# EAGLE design ABMS - VFG - TTL (EAGLE 5.10)
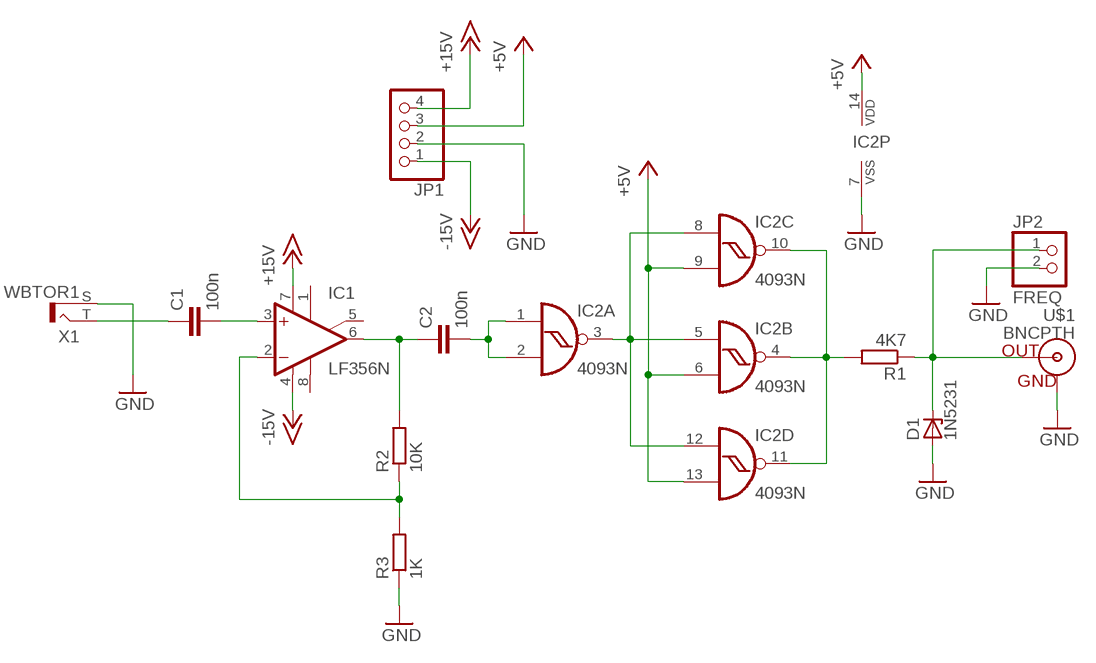
[diagram p0: schematic, sheet 1]

## Parts
C1  100n  C-EU075-032X103  [C075-032X103]
C2  100n  C-EU075-032X103  [C075-032X103]
D1  1N5231  ZENER-DIODEDO41Z10  [DO41Z10]
IC1  LF356N  [DIL08]
IC2  4093N  [DIL14]
JP1  PINHD-1X4  [1X04]
JP2  FREQ  PINHD-1X2  [1X02]
R1  4K7  R-EU_0207/10  [0207/10]
R2  10K  R-EU_0207/10  [0207/10]
R3  1K  R-EU_0207/10  [0207/10]
U$1  BNCPTH  [BNC]
X1  WBTOR1  [WBTOR1]

## Nets
+5V: IC2.6(B:I1) IC2.9(C:I1) IC2.13(D:I1) IC2.14(P:VDD) JP1.3
+15V: IC1.7(V+) JP1.4
-15V: IC1.4(V-) JP1.1
GND: D1.A IC2.7(P:VSS) JP1.2 JP2.2 R3.1 U$1.GND X1.S
N$1: IC2.3(A:O) IC2.5(B:I0) IC2.8(C:I0) IC2.12(D:I0)
N$3: C2.1 IC1.6(OUT) R2.2
N$4: IC2.4(B:O) IC2.10(C:O) IC2.11(D:O) R1.2
N$5: C2.2 IC2.1(A:I0) IC2.2(A:I1)
N$6: IC1.2(-IN) R2.1 R3.2
N$7: C1.2 IC1.3(+IN)
N$8: D1.C JP2.1 R1.1 U$1.S(OUT)
N$9: C1.1 X1.T
Unconnected: IC1.1(ON1) IC1.5(ON2) IC1.8(OPT)

## Library data of the parts
C1 C2 = resistor:C-EU: CAPACITOR, European symbol
D1 = diode:ZENER-DIODE: Z-Diode
IC1 = linear:LF356: OP AMP
IC2 = 40xx:4093: Quad 2-input NAND schmitt trigger
JP1 = pinhead:PINHD-1X4: PIN HEADER
JP2 = pinhead:PINHD-1X2: PIN HEADER
R1-R3 = resistor:R-EU_: RESISTOR, European symbol
U$1 = SparkFun:BNC: BNC Connector, Mouser Part# 5227161
X1 = con-lumberg:WBTOR1: RCA connectors according to JEITA RC-5231 Cinch RCA-Einbaukupplung nach JEITA RC-5231, abgewinkelte Ausführung Source: http://www.lumberg.de/Produkte/PDFs/WBTOR1.pdf

## Net classes
0 default: width 0.508 mm, drill 0.762 mm, clearance 0.508 mm

## Board
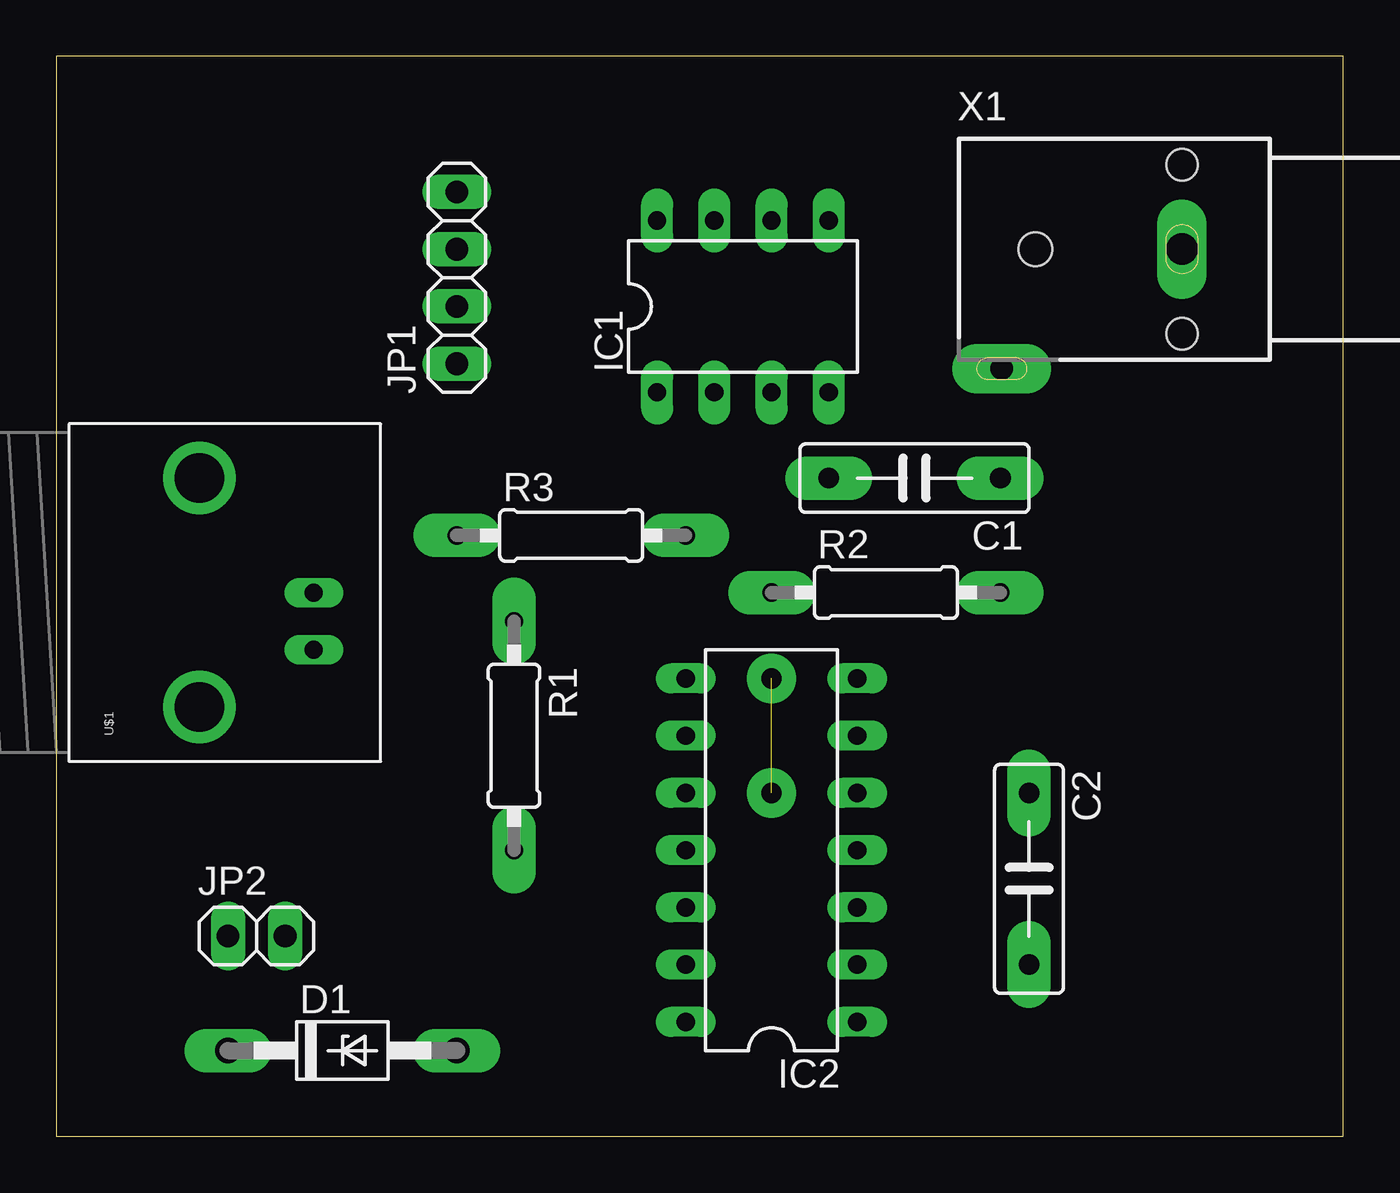
[diagram p1: board, top side]
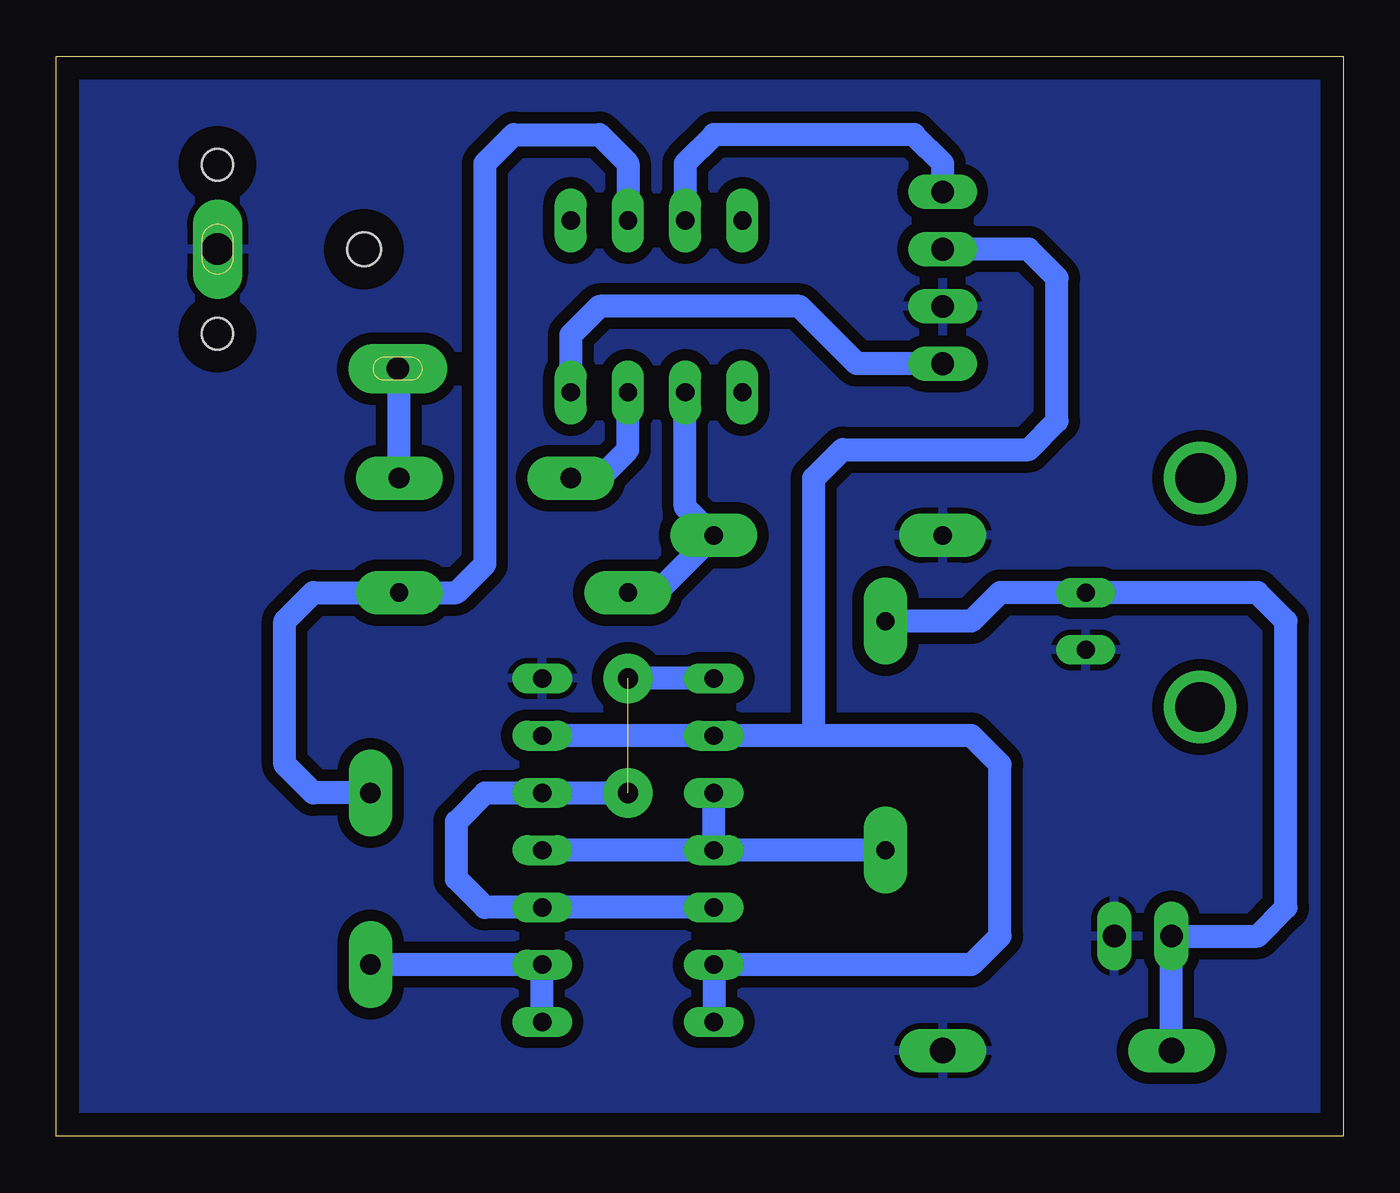
[diagram p2: board, bottom side, seen from below]

Size 57.13 x 47.93 mm. Coordinates in mm from the lower left corner, seen from the top.
Outline: 0,0 57.13,0 57.13,47.93 0,47.93 0,0
Copper layers (1*16): Top 0.035mm / dielectric 1.5mm / Bottom 0.035mm
Design rules "default": minimum track width 10mil, minimum drill 24mil, track to track 8mil, track to pad 8mil, pad to pad 8mil, via to via 8mil, smd to smd 8mil, copper to edge 40mil, drill to drill 8mil, minimum pad ring 10mil, minimum via ring 8mil, stop-mask expansion 4mil, vias tented up to drill 0mil, thermal gap 10mil

### Footprints (pad centres in the part's own frame; a part is rotated, then mirrored left to right if it is on the bottom)
C075-032X103 = drill 0.914 pad 1.93 long: 1 -3.81,0; 2 3.81,0
DO41Z10 = drill 1.118 pad 1.93 long: A 5.08,0; C -5.08,0
DIL08 = drill 0.813 pad 1.422 long: 1 -3.81,-3.81; 2 -1.27,-3.81; 3 1.27,-3.81; 4 3.81,-3.81; 5 3.81,3.81; 6 1.27,3.81; 7 -1.27,3.81; 8 -3.81,3.81
DIL14 = drill 0.813 long: 1 -7.62,-3.81; 2 -5.08,-3.81; 3 -2.54,-3.81; 4 0,-3.81; 5 2.54,-3.81; 6 5.08,-3.81; 7 7.62,-3.81; 8 7.62,3.81; 9 5.08,3.81; 10 2.54,3.81; 11 0,3.81; 12 -2.54,3.81; 13 -5.08,3.81; 14 -7.62,3.81
1X04 = drill 1.016 long: 1 -3.81,0; 2 -1.27,0; 3 1.27,0; 4 3.81,0
1X02 = drill 1.016 long: 1 -1.27,0; 2 1.27,0
0207/10 = drill 0.813 pad 1.93 long: 1 -5.08,0; 2 5.08,0
BNC = drill 2.2 round: 3 -5.08,5.08; 4 5.08,5.08 | drill 0.8 long: GND -2.54,0; S 0,0
WBTOR1 = drill 1.4 pad 2.2 long: S 0,-4 | drill 1 pad 2.2 long: T 5.3,-12 | hole 1.4: -3.75,-4; 3.75,-4 | hole 1.5: 0,-10.5

### Placement (x,y rotation side)
C1  38.1,29.21 180 top
C2  43.18,11.43 270 top
D1  12.7,3.81 0 top
IC1  30.48,36.83 0 top
IC2  31.75,12.7 90 top
JP1  17.78,38.1 90 top
JP2  8.89,8.89 0 top
R1  20.32,17.78 270 top
R2  36.83,24.13 0 top
R3  22.86,26.67 0 top
U$1  11.43,24.13 90 top
X1  53.98,39.37 270 top

### Tracks (layer width: path | path; a pad name or v marks a point on that pad's centre or on a via)
+5V
  Bottom 1.016: IC2.6 IC2.9 23.5,17.78 | 23.5,17.78 16.51,17.78 15.24,16.51 15.24,8.89 16.51,7.62 IC2.13 IC2.14 | JP1.3 13.97,39.37 12.7,38.1 12.7,31.75 13.97,30.48 22.23,30.48 23.5,29.21 23.5,17.78
+15V
  Bottom 1.016: JP1.4 17.78,43.18 19.05,44.45 27.94,44.45 29.21,43.18 IC1.7
-15V
  Bottom 1.016: IC1.4 34.29,35.56 33.02,36.83 24.13,36.83 21.59,34.29 JP1.1
GND
  pour Bottom: -1.27,49.53 58.42,49.53 58.42,-1.27 -1.27,-1.27
N$1  (1 unrouted)
  Bottom 1.016: IC2.12 IC2.3 38.1,10.16 39.37,11.43 39.37,13.97 38.1,15.24 IC2.5 31.75,15.24 | IC2.8 31.75,20.32
N$2  (via drill 0.9 pad 2.18)
  other vias: 31.75,20.32
N$3
  Bottom 1.016: IC1.6 31.75,43.18 33.02,44.45 36.83,44.45 38.1,43.18 38.1,25.4 39.37,24.13 R2.2 45.72,24.13 46.99,22.86 46.99,16.51 45.72,15.24 C2.1
N$4
  Bottom 1.016: IC2.11 IC2.10 | IC2.11 IC2.4 | R1.2 IC2.11
N$5
  Bottom 1.016: IC2.1 IC2.2 C2.2
N$6
  Bottom 1.016: IC1.2 29.21,27.94 R3.2 30.48,24.13 R2.1
N$7
  Bottom 1.016: IC1.3 31.75,30.48 33.02,29.21 C1.2
N$8
  Bottom 1.016: D1.C JP2.1 3.81,8.89 2.54,10.16 2.54,22.86 3.81,24.13 U$1.S 15.24,24.13 16.51,22.86 R1.1
N$9
  Bottom 1.016: C1.1 41.91,34.13 | 41.91,34.13 41.91,34.29 | 41.91,34.13 X1.T
N$10  (via drill 0.9 pad 2.18)
  other vias: 31.75,15.24